# EAGLE design Controller_v1 (EAGLE 6.4)
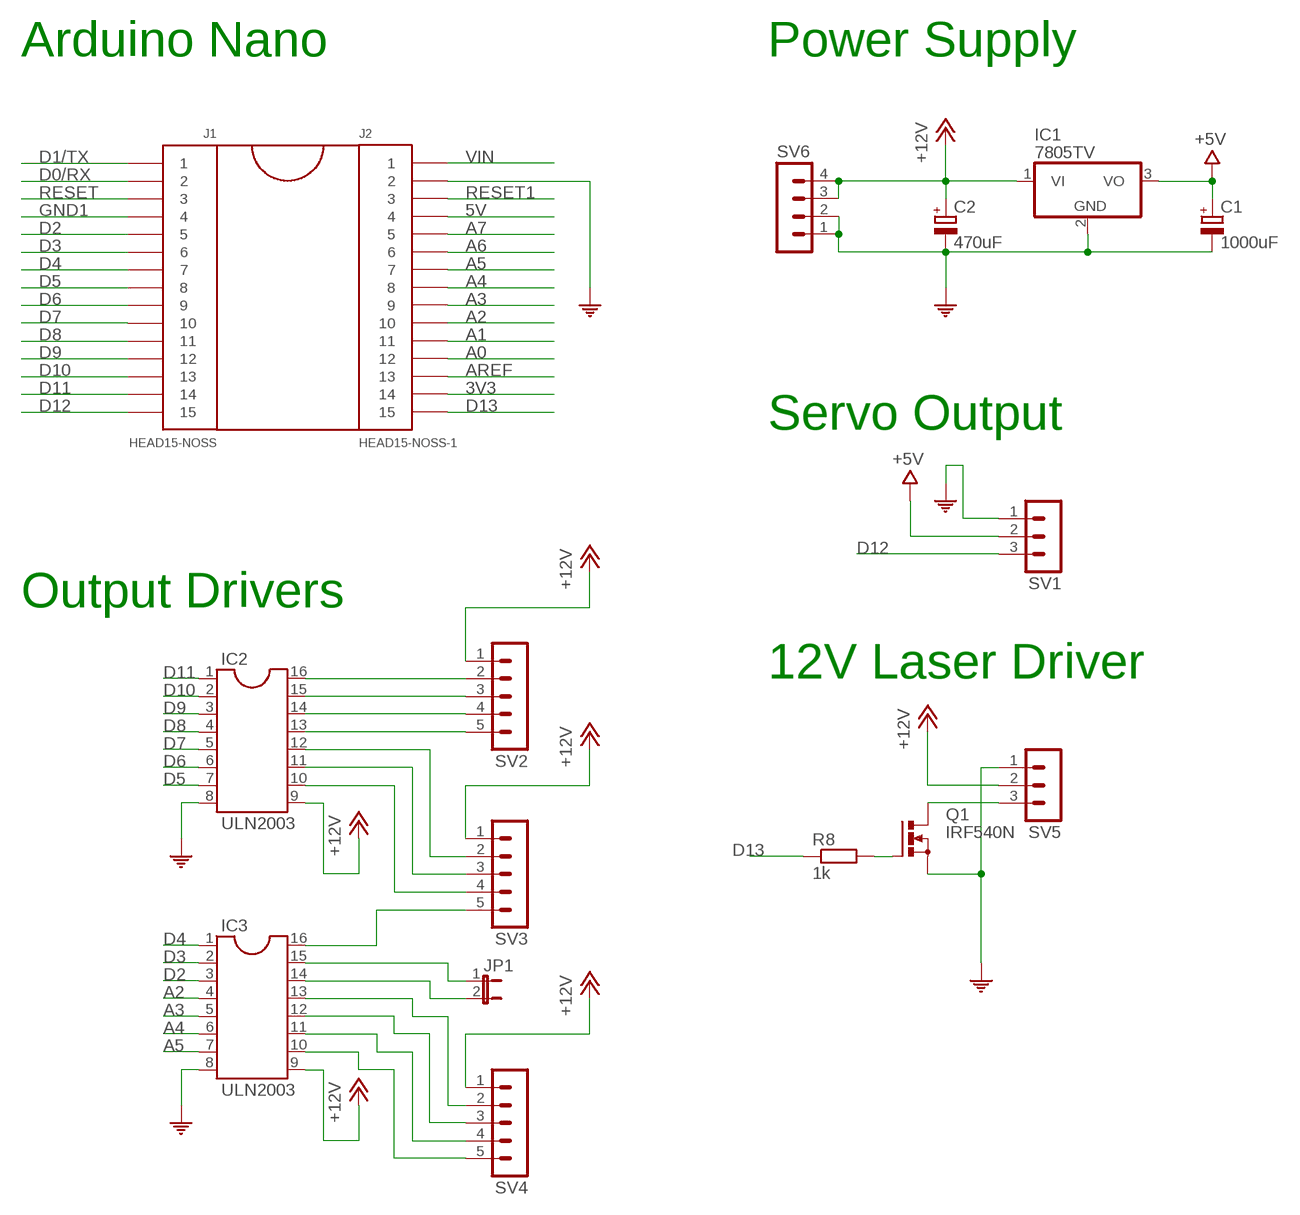
[diagram p0: schematic, sheet 1]

## Parts
C1  1000uF  CPOL-EUTAP5-70  [TAP5-70]
C2  470uF  CPOL-EUTAP5-70  [TAP5-70]
IC1  7805TV  [TO220V]
IC2  ULN2003  DIL16  [DIL16]
IC3  ULN2003  DIL16  [DIL16]
J1  HEAD15-NOSS  [HEAD15-NOSS]
J2  HEAD15-NOSS-1  [HEAD15-NOSS-1]
JP1  JP1E  [JP1]
Q1  IRF540N  PMOSFET_NTO220BV  [TO220BV]
R8  1k  R-EU_0207/10  [0207/10]
SV1  MA03-1  [MA03-1]
SV2  MA05-1  [MA05-1]
SV3  MA05-1  [MA05-1]
SV4  MA05-1  [MA05-1]
SV5  MA03-1  [MA03-1]
SV6  MA04-1  [MA04-1]

## Nets
3V3: J2.14
5V: J2.4
+5V: C1.+ IC1.3(VO) SV1.2
+12V: C2.+ IC1.1(VI) IC2.9 IC3.9 SV2.1 SV3.1 SV4.1 SV5.2 SV6.3 SV6.4
A0: J2.12
A1: J2.11
A2: IC3.4 J2.10
A3: IC3.5 J2.9
A4: IC3.6 J2.8
A5: IC3.7 J2.7
A6: J2.6
A7: J2.5
AREF: J2.13
COM: C1.- C2.- IC1.2(GND) IC2.8 IC3.8 J2.2 Q1.S SV1.1 SV5.1 SV6.1 SV6.2
D0/RX: J1.2
D1/TX: J1.1
D2: IC3.3 J1.5
D3: IC3.2 J1.6
D4: IC3.1 J1.7
D5: IC2.7 J1.8
D6: IC2.6 J1.9
D7: IC2.5 J1.10
D8: IC2.4 J1.11
D9: IC2.3 J1.12
D10: IC2.2 J1.13
D11: IC2.1 J1.14
D12: J1.15 SV1.3
D13: J2.15 R8.1
GND1: J1.4
N$1: IC3.15 JP1.1
N$2: IC3.14 JP1.2
N$3: IC3.13 SV4.2
N$4: IC3.12 SV4.3
N$5: IC3.16 SV3.5
N$6: IC3.11 SV4.4
N$7: IC3.10 SV4.5
N$20: Q1.D SV5.3
N$21: Q1.G R8.2
N$22: IC2.16 SV2.2
N$23: IC2.15 SV2.3
N$29: IC2.14 SV2.4
N$30: IC2.13 SV2.5
N$31: IC2.12 SV3.2
N$32: IC2.11 SV3.3
N$33: IC2.10 SV3.4
RESET: J1.3
RESET1: J2.3
VIN: J2.1

## Notes on the sheet
- Arduino Nano | Power Supply
- Servo Output
- Output Drivers
- 12V Laser Driver

## Library data of the parts
C1 C2 = resistor:CPOL-EU: POLARIZED CAPACITOR, European symbol
IC1 = linear:78*: Positive VOLTAGE REGULATOR Source: http://cache.national.com/ds/LM/LM78L05.pdf http://www.fairchildsemi.com/ds/LM/LM7805.pdf
IC2 IC3 = ic-package:DIL16: Dual In Line / Socket
J1 = MyCON2:HEAD15-NOSS
J2 = MyCON2:HEAD15-NOSS-1
JP1 = jumper:JP1E: JUMPER
Q1 = transistor-power:PMOSFET_N: Power MOSFET N-Channel
R8 = resistor:R-EU_: RESISTOR, European symbol
SV1 SV5 = con-lstb:MA03-1: PIN HEADER; OC_FARNELL: unknown; OC_NEWARK: unknown
SV2-SV4 = con-lstb:MA05-1: PIN HEADER; OC_FARNELL: unknown; OC_NEWARK: unknown
SV6 = con-lstb:MA04-1: PIN HEADER; OC_FARNELL: unknown; OC_NEWARK: unknown

## Board
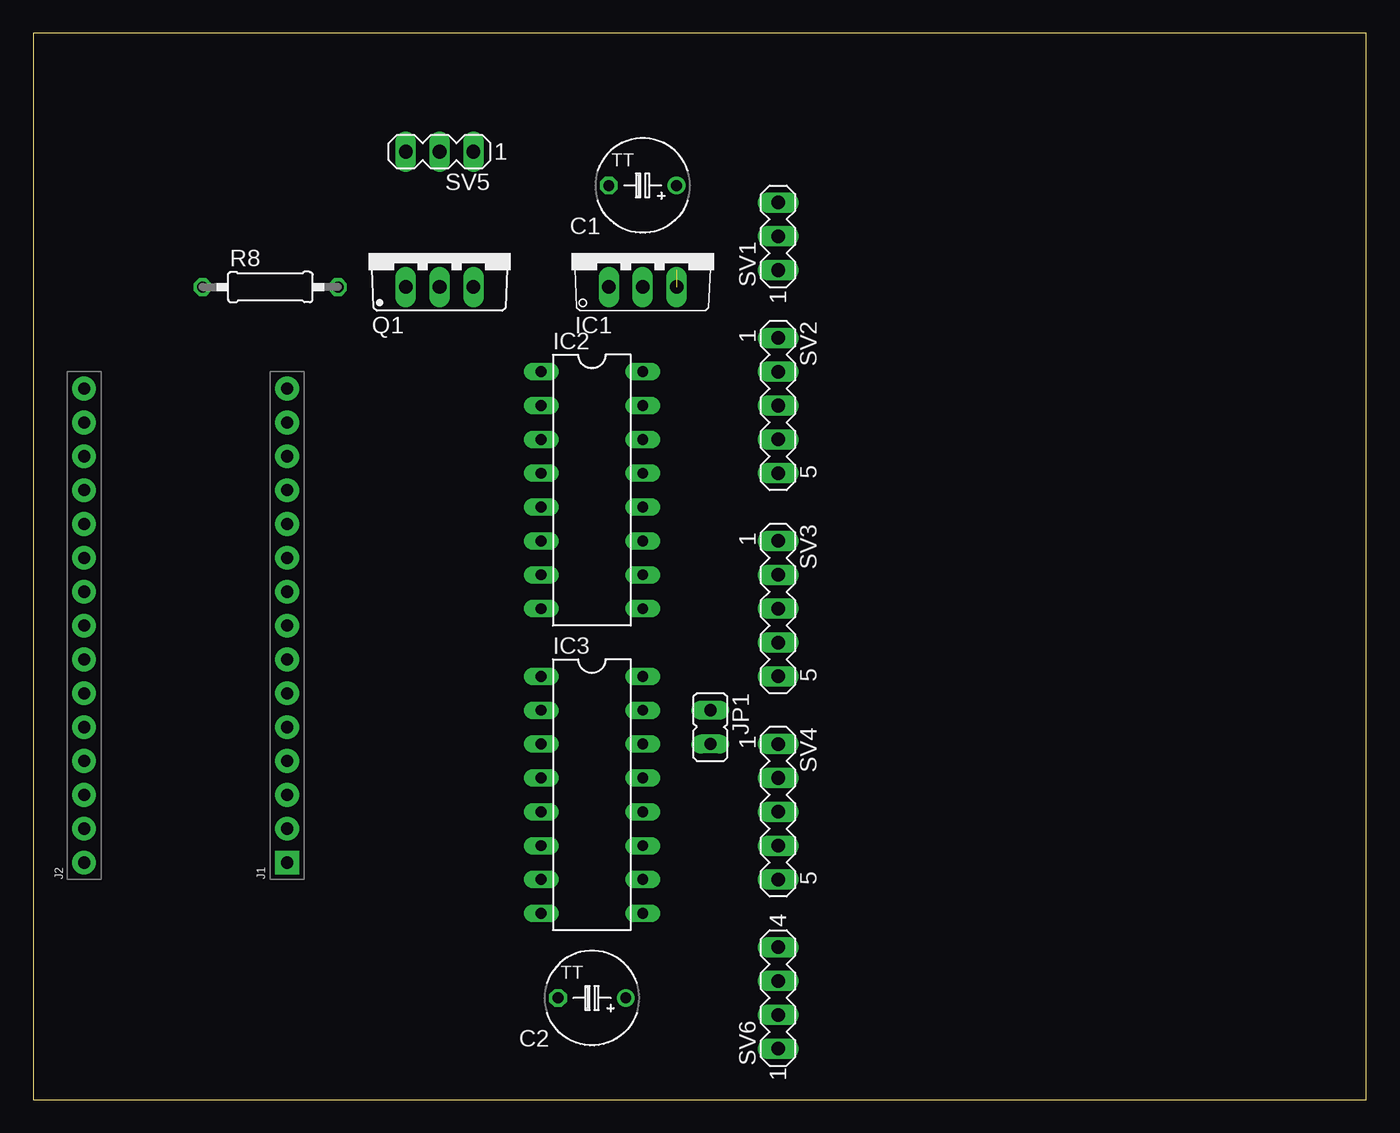
[diagram p1: board, top side]
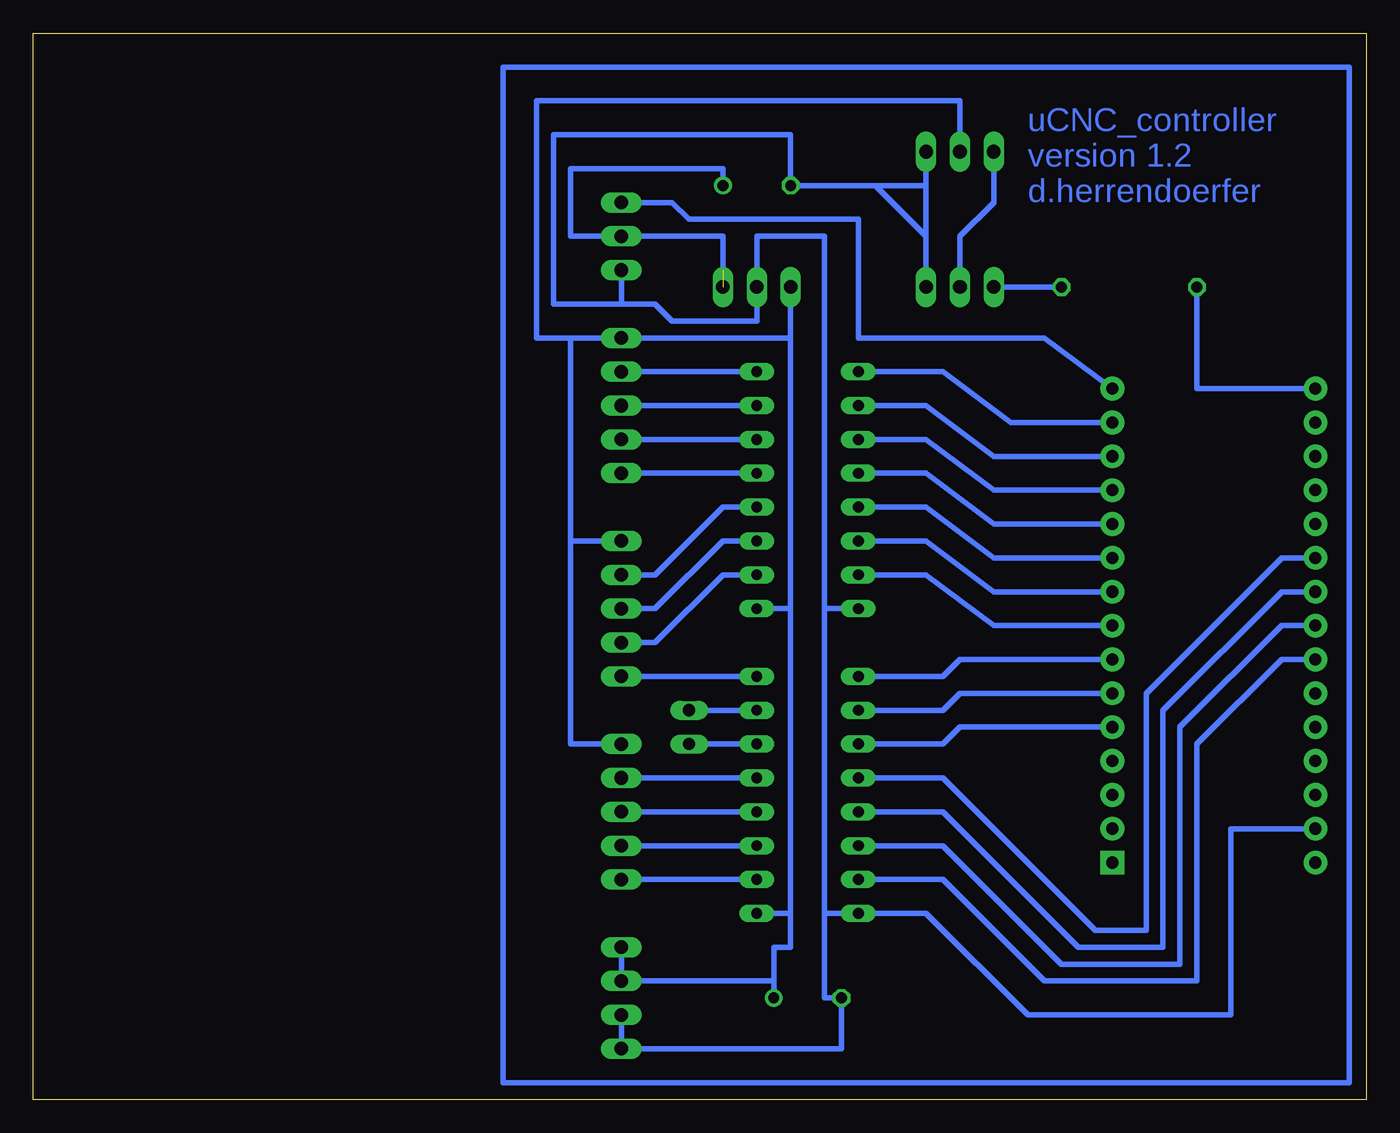
[diagram p2: board, bottom side, seen from below]

Size 100 x 80 mm. Coordinates in mm from the lower left corner, seen from the top.
Outline: 0,0 100,0 100,80 0,80 0,0
Copper layers (1*16): Top 0.035mm / dielectric 1.5mm / Bottom 0.035mm
Design rules "default": minimum track width 10mil, minimum drill 24mil, track to track 8mil, track to pad 8mil, pad to pad 8mil, via to via 8mil, smd to smd 8mil, copper to edge 40mil, drill to drill 8mil, minimum pad ring 10mil, minimum via ring 8mil, stop-mask expansion 4mil, vias tented up to drill 0mil, thermal gap 10mil

### Footprints (pad centres in the part's own frame; a part is rotated, then mirrored left to right if it is on the bottom)
TAP5-70 = drill 0.813: + -2.54,0 | drill 0.813 octagon: - 2.54,0
TO220V = drill 1.016 long: 1 -2.54,-2.54; 2 0,-2.54; 3 2.54,-2.54
DIL16 = drill 0.813 long: 1 -8.89,-3.81; 2 -6.35,-3.81; 3 -3.81,-3.81; 4 -1.27,-3.81; 5 1.27,-3.81; 6 3.81,-3.81; 7 6.35,-3.81; 8 8.89,-3.81; 9 8.89,3.81; 10 6.35,3.81; 11 3.81,3.81; 12 1.27,3.81; 13 -1.27,3.81; 14 -3.81,3.81; 15 -6.35,3.81; 16 -8.89,3.81
HEAD15-NOSS = drill 0.914 pad 1.778 square: 1 0,0 | drill 0.914 pad 1.778: 2 2.54,0; 3 5.08,0; 4 7.62,0; 5 10.16,0; 6 12.7,0; 7 15.24,0; 8 17.78,0; 9 20.32,0; 10 22.86,0; 11 25.4,0; 12 27.94,0; 13 30.48,0; 14 33.02,0; 15 35.56,0
HEAD15-NOSS-1 = drill 0.914 pad 1.778: 1 0,0; 2 2.54,0; 3 5.08,0; 4 7.62,0; 5 10.16,0; 6 12.7,0; 7 15.24,0; 8 17.78,0; 9 20.32,0; 10 22.86,0; 11 25.4,0; 12 27.94,0; 13 30.48,0; 14 33.02,0; 15 35.56,0
JP1 = drill 0.914 long: 1 0,-1.27; 2 0,1.27
TO220BV = drill 1.016 long: D 0,-2.54; G -2.54,-2.54; S 2.54,-2.54
0207/10 = drill 0.813 octagon: 1 -5.08,0; 2 5.08,0
MA03-1 = drill 1.016 long: 1 -2.54,0; 2 0,0; 3 2.54,0
MA05-1 = drill 1.016 long: 1 -5.08,0; 2 -2.54,0; 3 0,0; 4 2.54,0; 5 5.08,0
MA04-1 = drill 1.016 long: 1 -3.81,0; 2 -1.27,0; 3 1.27,0; 4 3.81,0

### Placement (x,y rotation side)
C1  45.72,68.58 180 top
C2  41.91,7.62 180 top
IC1  45.72,63.5 0 top
IC2  41.91,45.72 270 top
IC3  41.91,22.86 270 top
J1  19.05,17.78 90 top
J2  3.81,17.78 90 top
JP1  50.8,27.94 180 top
Q1  30.48,63.5 0 top
R8  17.78,60.96 0 top
SV1  55.88,64.77 90 top
SV2  55.88,52.07 270 top
SV3  55.88,36.83 270 top
SV4  55.88,21.59 270 top
SV5  30.48,71.12 180 top
SV6  55.88,7.62 90 top

### Tracks (layer width: path | path; a pad name or v marks a point on that pad's centre or on a via)
+5V  (1 unrouted)
  Bottom 0.406: 48.26,62.23 48.26,64.77 SV1.2 59.69,64.77 59.69,69.85 48.26,69.85 C1.+
+12V
  Bottom 0.406: IC3.9 43.18,13.97 | 43.18,13.97 43.18,36.83 | 43.18,36.83 43.18,57.15 | 43.18,57.15 SV2.1 59.69,57.15 | 59.69,57.15 59.69,41.91 | 59.69,41.91 59.69,26.67 SV4.1 | SV3.1 59.69,41.91 | IC2.9 43.18,36.83 | 43.18,13.97 43.18,11.43 44.45,11.43 C2.+ 44.45,8.89 SV6.3 SV6.4 | 43.18,57.15 IC1.1 | 59.69,57.15 62.23,57.15 62.23,74.93 30.48,74.93 SV5.2
A2
  Bottom 0.406: IC3.4 31.75,24.13 20.32,12.7 16.51,12.7 16.51,30.48 6.35,40.64 J2.10
A3
  Bottom 0.406: J2.9 6.35,38.1 15.24,29.21 15.24,11.43 21.59,11.43 31.75,21.59 IC3.5
A4
  Bottom 0.406: IC3.6 31.75,19.05 22.86,10.16 13.97,10.16 13.97,27.94 6.35,35.56 J2.8
A5
  Bottom 0.406: J2.7 6.35,33.02 12.7,26.67 12.7,8.89 24.13,8.89 31.75,16.51 IC3.7
COM
  Bottom 0.406: 40.64,13.97 40.64,7.62 C2.- 39.37,3.81 SV6.1 SV6.2 | 40.64,13.97 IC3.8 33.02,13.97 25.4,6.35 10.16,6.35 10.16,20.32 J2.2 | 40.64,13.97 40.64,36.83 | 40.64,36.83 40.64,64.77 45.72,64.77 IC1.2 45.72,58.42 52.07,58.42 53.34,59.69 55.88,59.69 | IC2.8 40.64,36.83 | 55.88,59.69 60.96,59.69 60.96,72.39 43.18,72.39 C1.- 36.83,68.58 | 36.83,68.58 33.02,64.77 | 33.02,64.77 Q1.S | SV5.1 33.02,68.58 | 33.02,68.58 36.83,68.58 | 55.88,59.69 SV1.1 | 33.02,68.58 33.02,64.77
D2
  Bottom 0.406: IC3.3 31.75,26.67 30.48,27.94 J1.5
D3
  Bottom 0.406: J1.6 30.48,30.48 31.75,29.21 IC3.2
D4
  Bottom 0.406: IC3.1 31.75,31.75 30.48,33.02 J1.7
D5
  Bottom 0.406: J1.8 27.94,35.56 33.02,39.37 IC2.7
D6
  Bottom 0.406: IC2.6 33.02,41.91 27.94,38.1 J1.9
D7
  Bottom 0.406: J1.10 27.94,40.64 33.02,44.45 IC2.5
D8
  Bottom 0.406: IC2.4 33.02,46.99 27.94,43.18 J1.11
D9
  Bottom 0.406: J1.12 27.94,45.72 33.02,49.53 IC2.3
D10
  Bottom 0.406: IC2.2 33.02,52.07 27.94,48.26 J1.13
D11
  Bottom 0.406: J1.14 26.67,50.8 31.75,54.61 IC2.1
D12
  Bottom 0.406: J1.15 24.13,57.15 38.1,57.15 38.1,66.04 50.8,66.04 52.07,67.31 SV1.3
D13
  Bottom 0.406: R8.1 12.7,53.34 J2.15
N$1
  Bottom 0.406: IC3.15 JP1.1
N$2
  Bottom 0.406: JP1.2 IC3.14
N$3
  Bottom 0.406: IC3.13 SV4.2
N$4
  Bottom 0.406: SV4.3 IC3.12
N$5
  Bottom 0.406: SV3.5 IC3.16
N$6
  Bottom 0.406: IC3.11 SV4.4
N$7
  Bottom 0.406: SV4.5 IC3.10
N$8
  Bottom 0.406: 1.27,1.27 64.77,1.27 64.77,77.47 1.27,77.47 1.27,1.27
N$20
  Bottom 0.406: Q1.D 30.48,64.77 27.94,67.31 SV5.3
N$21
  Bottom 0.406: R8.2 Q1.G
N$22
  Bottom 0.406: IC2.16 SV2.2
N$23
  Bottom 0.406: IC2.15 SV2.3
N$29
  Bottom 0.406: IC2.14 SV2.4
N$30
  Bottom 0.406: IC2.13 SV2.5
N$31
  Bottom 0.406: IC2.12 48.26,44.45 53.34,39.37 SV3.2
N$32
  Bottom 0.406: SV3.3 53.34,36.83 48.26,41.91 IC2.11
N$33
  Bottom 0.406: IC2.10 48.26,39.37 53.34,34.29 SV3.4

### Text on the board
Bottom: uCNC_controller / version 1.2 / d.herrendoerfer